# EAGLE schematic ninjaNIRS_TriggerBox_Rev1a (EAGLE 7.7.0)
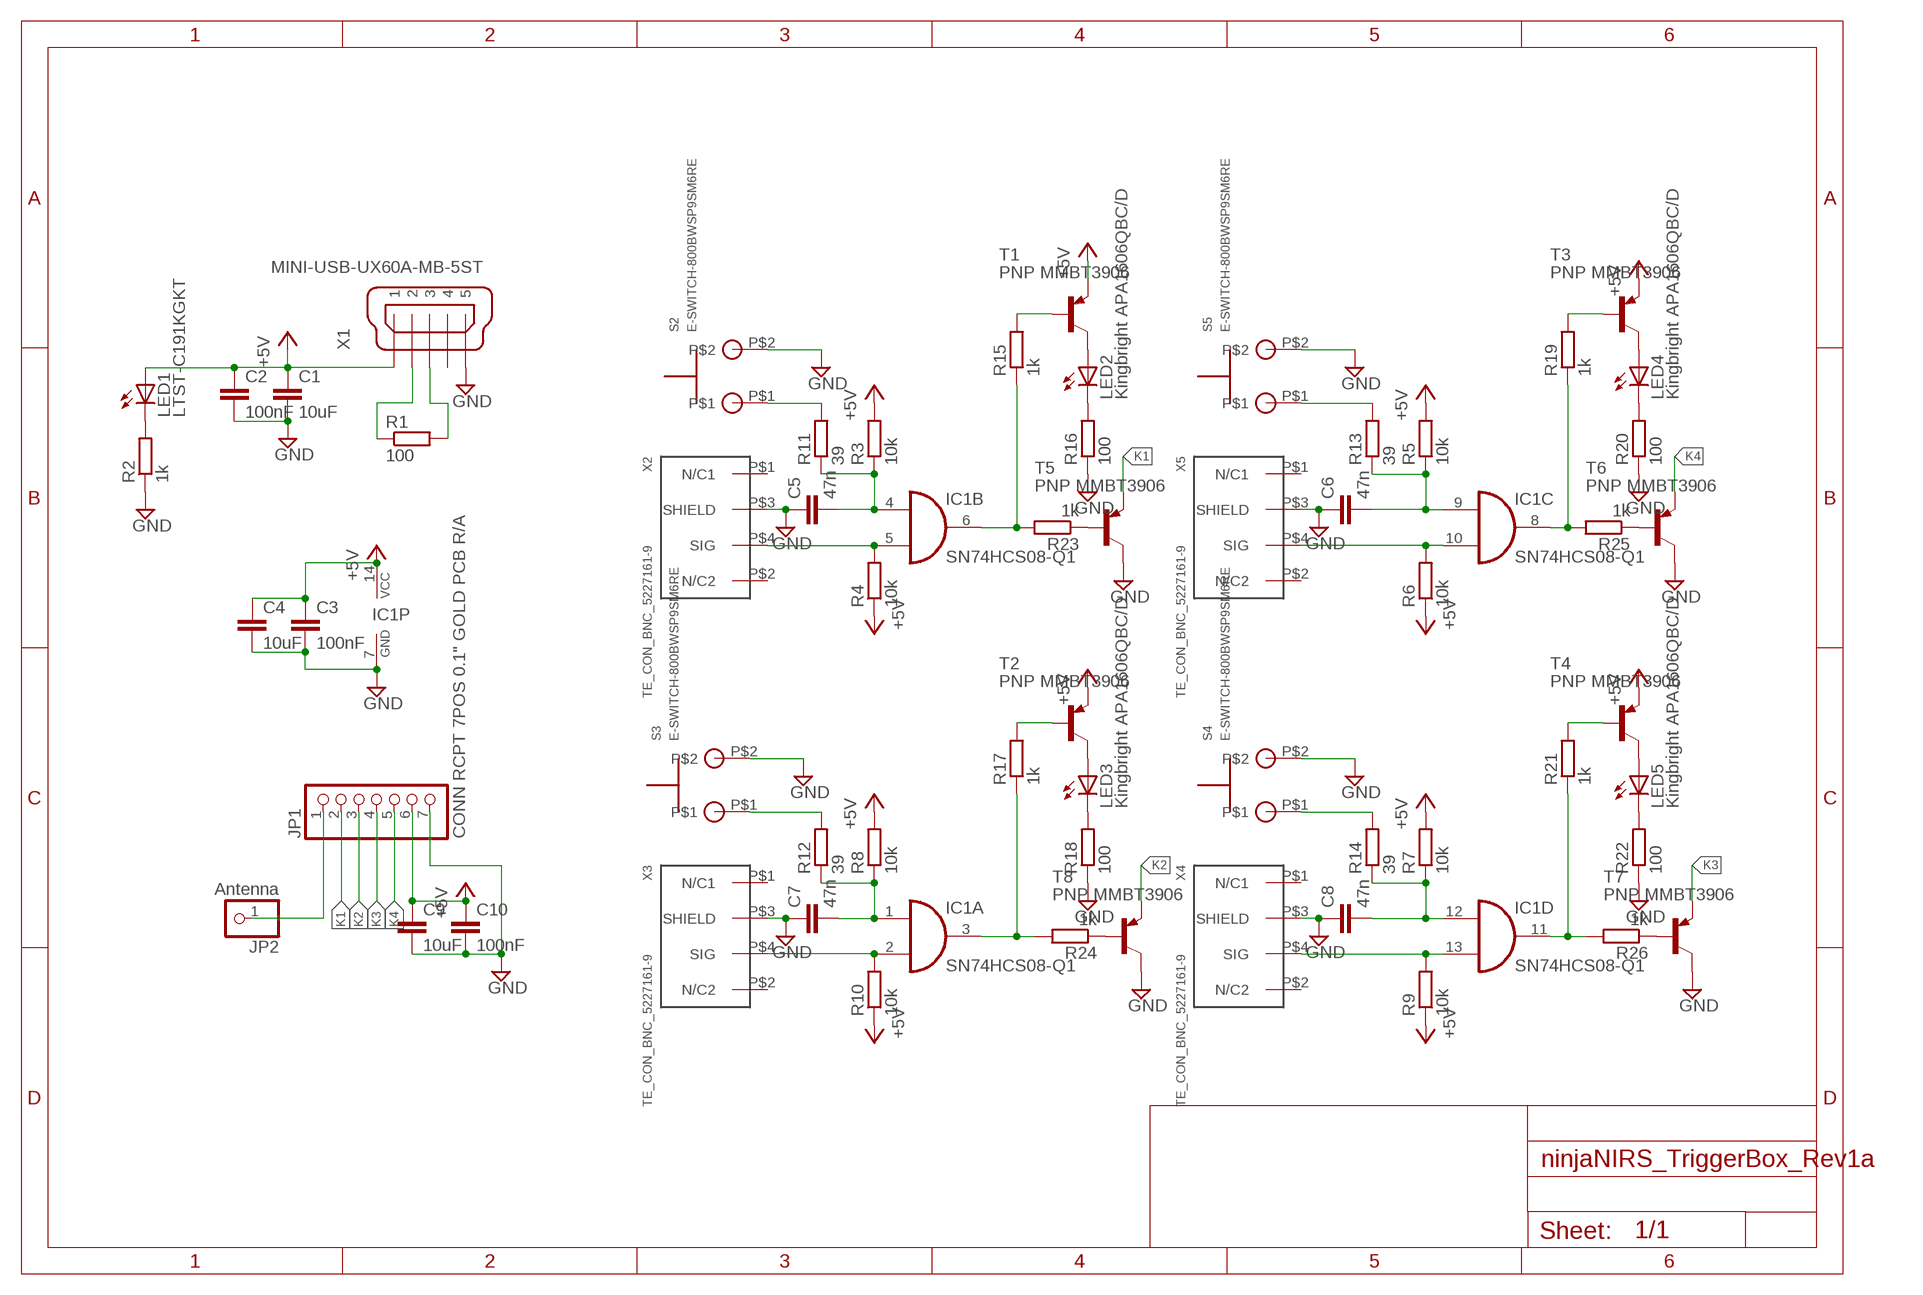
[diagram p0: schematic, sheet 1]

## Parts
C1  10uF  C-EUC1210  [C1210]
C2  100nF  C-EUC0805  [C0805]
C3  100nF  C-EUC0805  [C0805]
C4  10uF  C-EUC1210  [C1210]
C5  47n  C-EUC0805  [C0805]
C6  47n  C-EUC0805  [C0805]
C7  47n  C-EUC0805  [C0805]
C8  47n  C-EUC0805  [C0805]
C9  10uF  C-EUC1210  [C1210]
C10  100nF  C-EUC0805  [C0805]
IC1  SN74HCS08-Q1  74HC08D  [SO14]
JP1  CONN RCPT 7POS 0.1" GOLD PCB R/A  PINHD-1X7/90  [1X07/90]
JP2  Antenna  PINHD-1X1  [1X01]
LED1  LTST-C191KGKT  LEDCHIPLED_0603  [CHIPLED_0603]
LED2  Kingbright APA1606QBC/D  LEDCHIP-LED0603  [CHIP-LED0603]
LED3  Kingbright APA1606QBC/D  LEDCHIP-LED0603  [CHIP-LED0603]
LED4  Kingbright APA1606QBC/D  LEDCHIP-LED0603  [CHIP-LED0603]
LED5  Kingbright APA1606QBC/D  LEDCHIP-LED0603  [CHIP-LED0603]
R1  100  R-EU_R1206  [R1206]
R2  1k  R-EU_R1206  [R1206]
R3  10k  R-EU_R1206  [R1206]
R4  10k  R-EU_R1206  [R1206]
R5  10k  R-EU_R1206  [R1206]
R6  10k  R-EU_R1206  [R1206]
R7  10k  R-EU_R1206  [R1206]
R8  10k  R-EU_R1206  [R1206]
R9  10k  R-EU_R1206  [R1206]
R10  10k  R-EU_R1206  [R1206]
R11  39  R-EU_R1206  [R1206]
R12  39  R-EU_R1206  [R1206]
R13  39  R-EU_R1206  [R1206]
R14  39  R-EU_R1206  [R1206]
R15  1k  R-EU_R1206  [R1206]
R16  100  R-EU_R1206  [R1206]
R17  1k  R-EU_R1206  [R1206]
R18  100  R-EU_R1206  [R1206]
R19  1k  R-EU_R1206  [R1206]
R20  100  R-EU_R1206  [R1206]
R21  1k  R-EU_R1206  [R1206]
R22  100  R-EU_R1206  [R1206]
R23  1k  R-EU_R1206  [R1206]
R24  1k  R-EU_R1206  [R1206]
R25  1k  R-EU_R1206  [R1206]
R26  1k  R-EU_R1206  [R1206]
S2  E-SWITCH-800BWSP9SM6RE  [E-SWITCH_800BW]
S3  E-SWITCH-800BWSP9SM6RE  [E-SWITCH_800BW]
S4  E-SWITCH-800BWSP9SM6RE  [E-SWITCH_800BW]
S5  E-SWITCH-800BWSP9SM6RE  [E-SWITCH_800BW]
T1  PNP MMBT3906  BC807-16-PNP-SOT23-BEC  [SOT23-BEC]
T2  PNP MMBT3906  BC807-16-PNP-SOT23-BEC  [SOT23-BEC]
T3  PNP MMBT3906  BC807-16-PNP-SOT23-BEC  [SOT23-BEC]
T4  PNP MMBT3906  BC807-16-PNP-SOT23-BEC  [SOT23-BEC]
T5  PNP MMBT3906  BC807-16-PNP-SOT23-BEC  [SOT23-BEC]
T6  PNP MMBT3906  BC807-16-PNP-SOT23-BEC  [SOT23-BEC]
T7  PNP MMBT3906  BC807-16-PNP-SOT23-BEC  [SOT23-BEC]
T8  PNP MMBT3906  BC807-16-PNP-SOT23-BEC  [SOT23-BEC]
X1  MINI-USB-UX60A-MB-5ST  [UX60A-MB-5ST]
X2  TE_CON_BNC_5227161-9  [TE_CON_BNC_5227161-9]
X3  TE_CON_BNC_5227161-9  [TE_CON_BNC_5227161-9]
X4  TE_CON_BNC_5227161-9  [TE_CON_BNC_5227161-9]
X5  TE_CON_BNC_5227161-9  [TE_CON_BNC_5227161-9]

## Nets
+5V: C1.1 C2.1 C3.1 C4.1 C9.1 C10.1 IC1.14(P:VCC) JP1.6 LED1.A R3.2 R4.1 R5.2 R6.1 R7.2 R8.2 R9.1 R10.1 T1.E T2.E T3.E T4.E X1.1
GND: C1.2 C2.2 C3.2 C4.2 C5.1 C6.1 C7.1 C8.1 C9.2 C10.2 IC1.7(P:GND) JP1.7 R2.1 R16.1 R18.1 R20.1 R22.1 S2.P$2 S3.P$2 S4.P$2 S5.P$2 T5.C T6.C T7.C T8.C X1.5 X2.P$3(SHIELD) X3.P$3(SHIELD) X4.P$3(SHIELD) X5.P$3(SHIELD)
K1: JP1.2 T5.E
K1S: IC1.6(B:O) R15.1 R23.2
K2: JP1.3 T8.E
K2S: IC1.3(A:O) R17.1 R24.2
K3: JP1.4 T7.E
K3S: IC1.11(D:O) R21.1 R26.2
K4: JP1.5 T6.E
K4S: IC1.8(C:O) R19.1 R25.2
N$1: R1.1 X1.2
N$2: R1.2 X1.3
N$3: IC1.5(B:I1) R4.2 X2.P$4(SIG)
N$4: C5.2 IC1.4(B:I0) R3.1 R11.1
N$5: IC1.10(C:I1) R6.2 X5.P$4(SIG)
N$6: IC1.2(A:I1) R10.2 X3.P$4(SIG)
N$7: IC1.13(D:I1) R9.2 X4.P$4(SIG)
N$8: C6.2 IC1.9(C:I0) R5.1 R13.1
N$9: C7.2 IC1.1(A:I0) R8.1 R12.1
N$10: R12.2 S3.P$1
N$11: R14.2 S4.P$1
N$12: R13.2 S5.P$1
N$13: LED1.C R2.2
N$14: R11.2 S2.P$1
N$15: C8.2 IC1.12(D:I0) R7.1 R14.1
N$16: R15.2 T1.B
N$17: LED2.A T1.C
N$18: LED2.C R16.2
N$19: R17.2 T2.B
N$20: LED3.A T2.C
N$21: LED3.C R18.2
N$22: R19.2 T3.B
N$23: LED4.A T3.C
N$24: LED4.C R20.2
N$25: R21.2 T4.B
N$26: LED5.A T4.C
N$27: LED5.C R22.2
N$28: R23.1 T5.B
N$29: R25.1 T6.B
N$30: R26.1 T7.B
N$31: JP1.1 JP2.1
N$32: R24.1 T8.B
Unconnected: X1.4 X2.P$1(N/C1) X2.P$2(N/C2) X3.P$1(N/C1) X3.P$2(N/C2) X4.P$1(N/C1) X4.P$2(N/C2) X5.P$1(N/C1) X5.P$2(N/C2)

## Library data of the parts
C1-C10 = rcl:C-EU: CAPACITOR, European symbol
IC1 = 74xx-eu:74*08: Quad 2-input AND gate
JP1 = pinhead:PINHD-1X7: PIN HEADER
JP2 = pinhead:PINHD-1X1: PIN HEADER
LED1-LED5 = led:LED: LED OSRAM: - CHIPLED LG R971, LG N971, LY N971, LG Q971, LY Q971, LO R971, LY R971 LH N974, LH R974 LS Q976, LO Q976, LY Q976 LO Q996 - Hyper CHIPLED LW Q18S LB Q993, LB Q99A, LB R99A - SideLED LS A670, LO A670, LY A670, LG A670, LP A670 LB A673, LV A673, LT A673, LW A673 LH A674 LY A675 LS A676, LA A676, LO A676, LY A676, LW A676 LS A679, LY A679, LG A679 - Hyper Micro SIDELED® LS Y876, LA Y876, LO Y876, LY Y876 LT Y87S - SmartLED LW L88C, LW L88S LB L89C, LB L89S, LG L890 LS L89K, LO L89K, LY L89K LS L896, LA L896, LO L896, LY L896 - TOPLED LS T670, LO T670, LY T670, LG T670, LP T670 LSG T670, LSP T670, LSY T670, LOP T670, LYG T670 LG T671, LOG T671, LSG T671 LB T673, LV T673, LT T673, LW T673 LH T674 LS T676, LA T676, LO T676, LY T676, LB T676, LH T676, LSB T676, LW T676 LB T67C, LV T67C, LT T67C, LS T67K, LO T67K, LY T67K, LW E67C LS E67B, LA E67B, LO E67B, LY E67B, LB E67C, LV E67C, LT E67C LW T67C LS T679, LY T679, LG T679 LS T770, LO T770, LY T770, LG T770, LP T770 LB T773, LV T773, LT T773, LW T773 LH T774 LS E675, LA E675, LY E675, LS T675 LS T776, LA T776, LO T776, LY T776, LB T776 LHGB T686 LT T68C, LB T68C - Hyper Mini TOPLED® LB M676 - Mini TOPLED Santana® LG M470 LS M47K, LO M47K, LY M47K Source: http://www.osram.convergy.de LUXEON: - LUMILED® LXK2-PW12-R00, LXK2-PW12-S00, LXK2-PW14-U00, LXK2-PW14-V00 LXK2-PM12-R00, LXK2-PM12-S00, LXK2-PM14-U00 LXK2-PE12-Q00, LXK2-PE12-R00, LXK2-PE12-S00, LXK2-PE14-T00, LXK2-PE14-U00 LXK2-PB12-K00, LXK2-PB12-L00, LXK2-PB12-M00, LXK2-PB14-N00, LXK2-PB14-P00, LXK2-PB14-Q00 LXK2-PR12-L00, LXK2-PR12-M00, LXK2-PR14-Q00, LXK2-PR14-R00 LXK2-PD12-Q00, LXK2-PD12-R00, LXK2-PD12-S00 LXK2-PH12-R00, LXK2-PH12-S00 LXK2-PL12-P00, LXK2-PL12-Q00, LXK2-PL12-R00 Source: www.luxeon.com KINGBRIGHT: KA-3528ASYC Source: www.kingbright.com
R1-R26 = rcl:R-EU_: RESISTOR, European symbol
S2-S5 = E-SWITCH-800BW:E-SWITCH-800BWSP9SM6RE
T1-T8 = transistor:*-PNP-: PNP Transistror
X1 = con-hirose:MINI-USB-: MINI USB Connector Source: http://www.hirose.co.jp/cataloge_hp/e24000019.pdf; OC_FARNELL: unknown; OC_NEWARK: unknown
X2-X5 = TE_CON_BNC_5227161-9:TE_CON_BNC_5227161-9